# EAGLE design board (EAGLE 9.6.2)
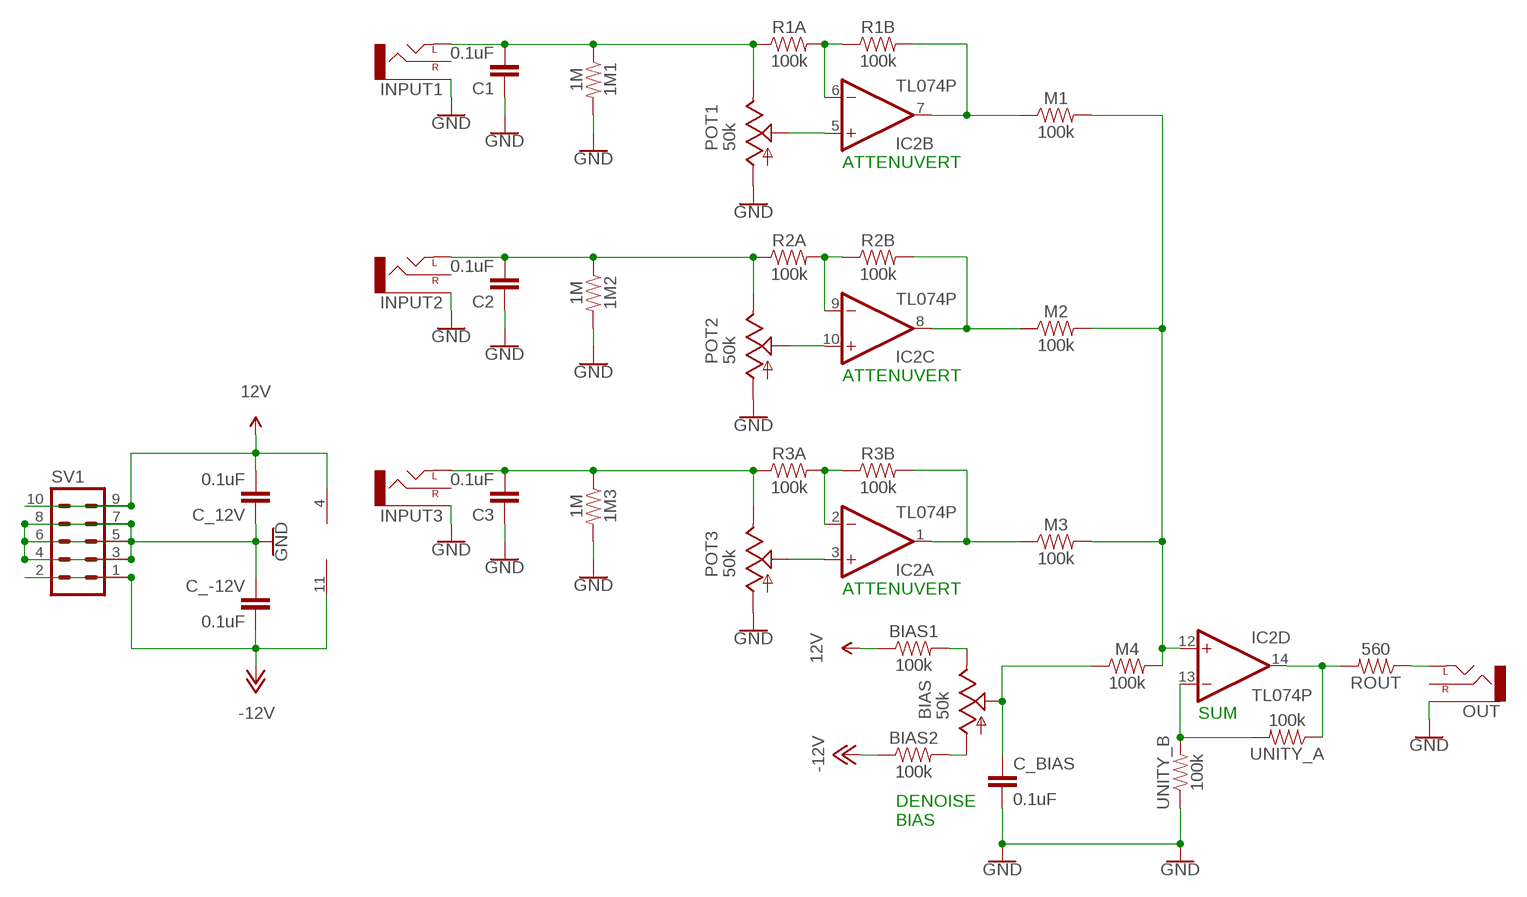
[diagram p0: schematic, sheet 1]

## Parts
1M1  1M  1MOHM-HORIZ-1/4W-5%  [AXIAL-0.3]
1M2  1M  1MOHM-HORIZ-1/4W-5%  [AXIAL-0.3]
1M3  1M  1MOHM-HORIZ-1/4W-5%  [AXIAL-0.3]
BIAS  50k  9MM_SNAP-IN_POT_  [9MM_SNAP-IN_POT]
BIAS1  100k  100KOHM-HORIZ-1/4W-1%  [AXIAL-0.3]
BIAS2  100k  100KOHM-HORIZ-1/4W-1%  [AXIAL-0.3]
C1  0.1uF  0.1UF-KIT-EZ-50V-20%  [CAP-PTH-SMALL-KIT]
C2  0.1uF  0.1UF-KIT-EZ-50V-20%  [CAP-PTH-SMALL-KIT]
C3  0.1uF  0.1UF-KIT-EZ-50V-20%  [CAP-PTH-SMALL-KIT]
C_12V  0.1uF  0.1UF-KIT-EZ-50V-20%  [CAP-PTH-SMALL-KIT]
C_-12V  0.1uF  0.1UF-KIT-EZ-50V-20%  [CAP-PTH-SMALL-KIT]
C_BIAS  0.1uF  0.1UF-KIT-EZ-50V-20%  [CAP-PTH-SMALL-KIT]
IC2  TL074P  [DIL14]
INPUT1  THONKI-STEREO  [WQP-PJ366ST_JACK]
INPUT2  THONKI-STEREO  [WQP-PJ366ST_JACK]
INPUT3  THONKI-STEREO  [WQP-PJ366ST_JACK]
M1  100k  100KOHM-HORIZ-1/4W-1%  [AXIAL-0.3]
M2  100k  100KOHM-HORIZ-1/4W-1%  [AXIAL-0.3]
M3  100k  100KOHM-HORIZ-1/4W-1%  [AXIAL-0.3]
M4  100k  100KOHM-HORIZ-1/4W-1%  [AXIAL-0.3]
OUT  THONKI-STEREO  [WQP-PJ366ST_JACK]
POT1  50k  9MM_SNAP-IN_POT_  [9MM_SNAP-IN_POT]
POT2  50k  9MM_SNAP-IN_POT_  [9MM_SNAP-IN_POT]
POT3  50k  9MM_SNAP-IN_POT_  [9MM_SNAP-IN_POT]
R1A  100k  100KOHM-HORIZ-1/4W-1%  [AXIAL-0.3]
R1B  100k  100KOHM-HORIZ-1/4W-1%  [AXIAL-0.3]
R2A  100k  100KOHM-HORIZ-1/4W-1%  [AXIAL-0.3]
R2B  100k  100KOHM-HORIZ-1/4W-1%  [AXIAL-0.3]
R3A  100k  100KOHM-HORIZ-1/4W-1%  [AXIAL-0.3]
R3B  100k  100KOHM-HORIZ-1/4W-1%  [AXIAL-0.3]
ROUT  560  100KOHM-HORIZ-1/4W-1%  [AXIAL-0.3]
SV1  EURO_POWER_HEADERFAT_PADS  [EURO_PWR_HEADER_FAT]
UNITY_A  100k  100KOHM-HORIZ-1/4W-1%  [AXIAL-0.3]
UNITY_B  100k  100KOHM-HORIZ-1/4W-1%  [AXIAL-0.3]

## Nets
12V: BIAS1.P$1 C_12V.2 IC2.4(P:V+) SV1.9 SV1.10
-12V: BIAS2.P$1 C_-12V.2 IC2.11(P:V-) SV1.1 SV1.2
GND: 1M1.P$2 1M2.P$2 1M3.P$2 C1.1 C2.1 C3.1 C_12V.1 C_-12V.1 C_BIAS.2 INPUT1.P$3_SLEEVE(SLEEVE) INPUT2.P$3_SLEEVE(SLEEVE) INPUT3.P$3_SLEEVE(SLEEVE) OUT.P$3_SLEEVE(SLEEVE) POT1.1(A) POT2.1(A) POT3.1(A) SV1.3 SV1.4 SV1.5 SV1.6 SV1.7 SV1.8 UNITY_B.P$1
N$1: OUT.P$1_TIP(LEFT) ROUT.P$1
N$3: IC2.14(D:OUT) ROUT.P$2 UNITY_A.P$1
N$4: BIAS1.P$2 BIAS.3(E)
N$5: BIAS2.P$2 BIAS.1(A)
N$6: BIAS.2(S) C_BIAS.1 M4.P$1
N$8: IC2.12(D:+IN) M1.P$2 M2.P$2 M3.P$2 M4.P$2
N$12: IC2.13(D:-IN) UNITY_A.P$2 UNITY_B.P$2
N$14: IC2.7(B:OUT) M1.P$1 R1B.P$2
N$15: IC2.6(B:-IN) R1A.P$2 R1B.P$1
N$16: 1M1.P$1 C1.2 INPUT1.P$1_TIP(LEFT) POT1.3(E) R1A.P$1
N$17: IC2.5(B:+IN) POT1.2(S)
N$18: IC2.8(C:OUT) M2.P$1 R2B.P$2
N$19: IC2.9(C:-IN) R2A.P$2 R2B.P$1
N$20: 1M2.P$1 C2.2 INPUT2.P$1_TIP(LEFT) POT2.3(E) R2A.P$1
N$21: IC2.10(C:+IN) POT2.2(S)
N$22: IC2.1(A:OUT) M3.P$1 R3B.P$2
N$23: IC2.2(A:-IN) R3A.P$2 R3B.P$1
N$24: 1M3.P$1 C3.2 INPUT3.P$1_TIP(LEFT) POT3.3(E) R3A.P$1
N$25: IC2.3(A:+IN) POT3.2(S)
Unconnected: INPUT1.P$2_SWITCH(RIGHT) INPUT2.P$2_SWITCH(RIGHT) INPUT3.P$2_SWITCH(RIGHT) OUT.P$2_SWITCH(RIGHT)

## Notes on the sheet
- ATTENUVERT
- ATTENUVERT
- ATTENUVERT
- SUM
- DENOISE
  BIAS

## Library data of the parts
1M1-1M3 = SparkFun-Resistors:1MOHM: 1MΩ resistor A resistor is a passive two-terminal electrical component that implements electrical resistance as a circuit element. Resistors act to reduce current flow, and, at the same time, act to lower voltage levels within circuits. - Wikipedia; PROD_ID: RES-09329
BIAS POT1-POT3 = MusicThingModular:9MM_SNAP-IN_POT: 9mm vertical snap-in pot, Alpha / Panasonic style
BIAS1 BIAS2 M1-M4 R1A R1B R2A R2B R3A R3B UNITY_A UNITY_B = SparkFun-Resistors:100KOHM: 100kΩ resistor A resistor is a passive two-terminal electrical component that implements electrical resistance as a circuit element. Resistors act to reduce current flow, and, at the same time, act to lower voltage levels within circuits. - Wikipedia; PROD_ID: RES-12184
C1-C3 C_12V C_-12V C_BIAS = SparkFun-Capacitors:0.1UF: 0.1µF ceramic capacitors A capacitor is a passive two-terminal electrical component used to store electrical energy temporarily in an electric field.; PROD_ID: CAP-08370
IC2 = linear:TL074: OP AMP
INPUT1-INPUT3 OUT = MusicThingModular:THONKI-STEREO: 3.5mm socket for Eurorack modular synths
ROUT = SparkFun-Resistors:100KOHM: 100kΩ resistor A resistor is a passive two-terminal electrical component that implements electrical resistance as a circuit element. Resistors act to reduce current flow, and, at the same time, act to lower voltage levels within circuits. - Wikipedia; PROD_ID: RES-12184; VALUE: 100k
SV1 = MusicThingModular:EURO_POWER_HEADER: Power Header 10 pin power header for Eurorack Power Supplies Variants with fatter pads for easier soldering, and the LOCK variant which has 5mil offset pins to hold the component in place before soldering

## Board
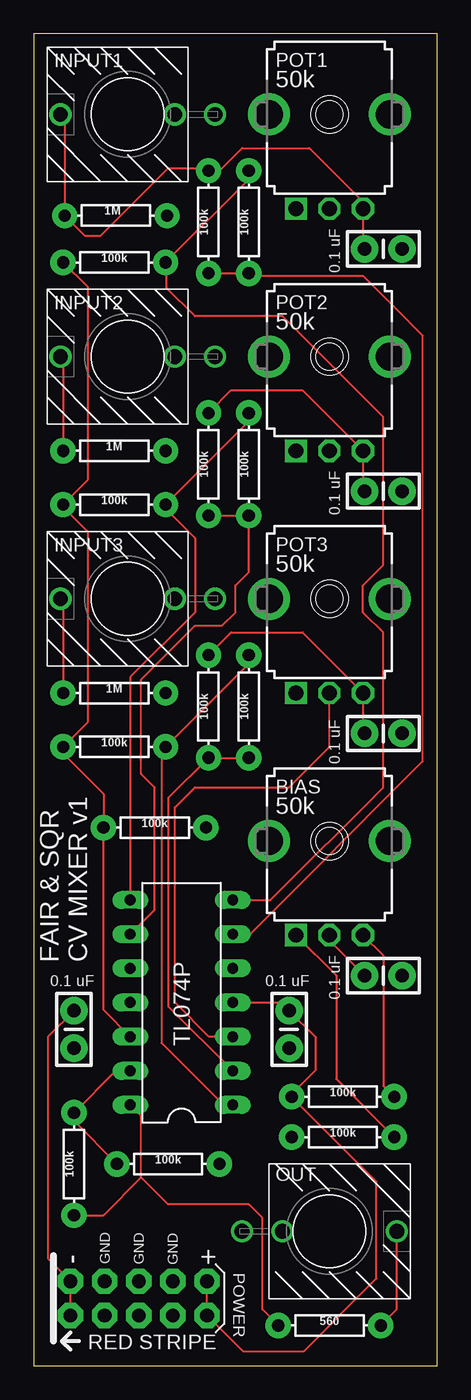
[diagram p1: board, top side]
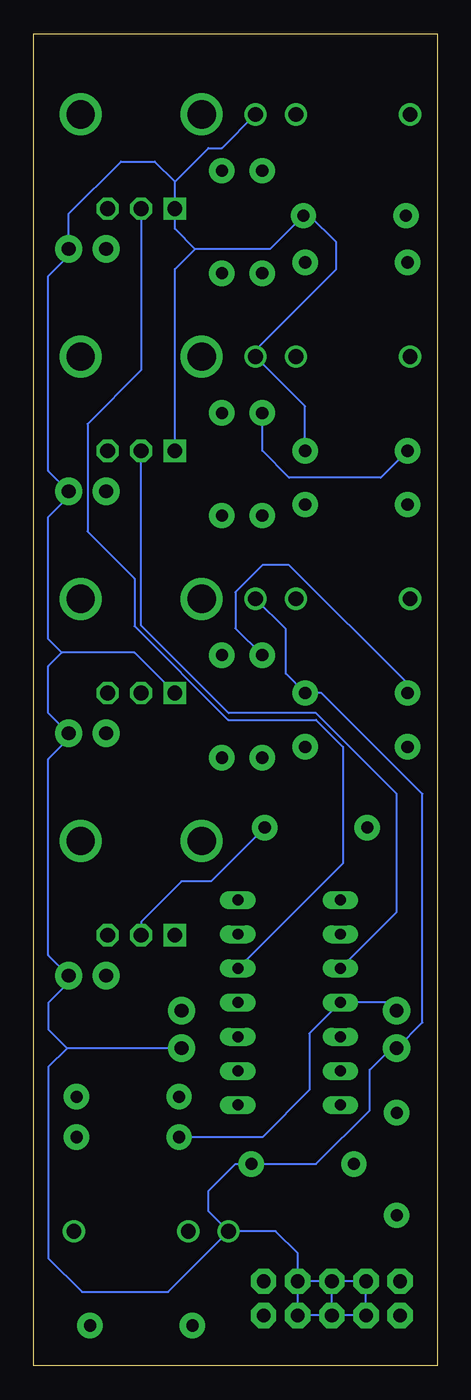
[diagram p2: board, bottom side, seen from below]

Size 30 x 99 mm. Coordinates in mm from the lower left corner, seen from the top.
Outline: 0,0 30,0 30,99 0,99 0,0
Copper layers (1*16): Top 0.035mm / dielectric 1.5mm / Bottom 0.035mm
Design rules "default": minimum track width 6mil, minimum drill 0.35mm, track to track 6mil, track to pad 6mil, pad to pad 6mil, via to via 6mil, smd to smd 6mil, copper to edge 40mil, drill to drill 6mil, minimum pad ring 10mil, minimum via ring 8mil, stop-mask expansion 4mil, vias tented up to drill 0mil, thermal gap 10mil

### Footprints (pad centres in the part's own frame; a part is rotated, then mirrored left to right if it is on the bottom)
AXIAL-0.3 = drill 0.9 pad 1.88: P$1 -3.81,0; P$2 3.81,0
9MM_SNAP-IN_POT = drill 1.1 square: 1 -2.5,-7 | drill 1.1 octagon: 2 0,-7; 3 2.5,-7 | drill 2.1 pad 2.794: CHASSIS1 -4.5,0; CHASSIS2 4.5,0
CAP-PTH-SMALL-KIT = drill 1.016 pad 2.032: 1 -1.397,0; 2 1.397,0
DIL14 = drill 0.813 long: 1 -7.62,-3.81; 2 -5.08,-3.81; 3 -2.54,-3.81; 4 0,-3.81; 5 2.54,-3.81; 6 5.08,-3.81; 7 7.62,-3.81; 8 7.62,3.81; 9 5.08,3.81; 10 2.54,3.81; 11 0,3.81; 12 -2.54,3.81; 13 -5.08,3.81; 14 -7.62,3.81
WQP-PJ366ST_JACK = drill 1.1: P$1_TIP 0,5; P$2_SWITCH 0,-3.5; P$3_SLEEVE 0,-6.5
EURO_PWR_HEADER_FAT = drill 1.016 pad 1.88 octagon: 1 -5.08,-1.27; 2 -5.08,1.27; 3 -2.54,-1.27; 4 -2.54,1.27; 5 0,-1.27; 6 0,1.27; 7 2.54,-1.27; 8 2.54,1.27; 9 5.08,-1.27; 10 5.08,1.27

### Placement (x,y rotation side)
1M1  6.12,85.48 0 top
1M2  6,68 0 top
1M3  6,50 0 top
BIAS  22,39 0 top
BIAS1  23,20 0 top
BIAS2  23,17 0 top
C1  26,83 180 top
C2  26,65 180 top
C3  26,47 180 top
C_12V  19,25 90 top
C_-12V  3,25 90 top
C_BIAS  26,29 0 top
IC2  11,27 90 top
INPUT1  7,93 90 top
INPUT2  7,75 90 top
INPUT3  7,57 90 top
M1  6,82 180 top
M2  6,64 180 top
M3  6,46 180 top
M4  9,40 180 top
OUT  22,10 270 top
POT1  22,93 0 top
POT2  22,75 0 top
POT3  22,57 0 top
R1A  13,85 270 top
R1B  16,85 90 top
R2A  13,67 270 top
R2B  16,67 90 top
R3A  13,49 270 top
R3B  16,49 90 top
ROUT  22,3 180 top
SV1  7.82,5.02 0 top
UNITY_A  3,15 90 top
UNITY_B  10,15 180 top

### Tracks (layer width: path | path; a pad name or v marks a point on that pad's centre or on a via)
12V
  Top 0.152: IC2.4 18.4,27 C_12V.2 21,24.4 21,22 19.19,20.19 BIAS1.P$1 25.5,13.69 25.5,6.5 20.09,1.09 15.56,1.09 SV1.9 SV1.10
-12V
  Top 0.152: SV1.1 SV1.2 1.09,7.94 1.09,24.49 C_-12V.2
  Bottom 0.152: C_-12V.2 3.6,27 IC2.11 9.5,24.69 9.5,20.5 13,17 BIAS2.P$1
GND
  Bottom 0.152: INPUT1.P$3_SLEEVE 16,90.5 17,90.5 19.5,88 | 18,83 12.41,83 1M1.P$2 9.48,85.48 7.5,83.5 7.5,81.5 13.5,75.5 INPUT2.P$3_SLEEVE 9.81,71.31 1M2.P$2 | 18,83 19.5,84.5 POT1.1 19.5,88 | 18,83 19.5,81.5 POT2.1 | SV1.5 SV1.6 | SV1.8 SV1.7 SV1.5 | SV1.6 SV1.4 SV1.3 SV1.5 | SV1.6 SV1.8 | SV1.8 10.36,8.36 12,10 OUT.P$3_SLEEVE | OUT.P$3_SLEEVE 20,5.5 26.41,5.5 28.91,8 28.91,22.21 27.51,23.6 | INPUT3.P$3_SLEEVE 11.25,54.75 11.25,51.44 1M3.P$2 8.59,50 1.09,42.5 1.09,25.51 C_-12V.1 3.4,23.6 5,22 5,19 9,15 UNITY_B.P$1 15,15 17,13 17,11.5 OUT.P$3_SLEEVE | POT3.1 22.5,53 27.91,53 | 27.91,53 28.91,52 28.91,48.51 C3.1 27.4,46.6 28.91,45.09 28.91,30.51 C_BIAS.2 27.4,28.5 28.91,26.99 28.91,25 27.51,23.6 | 27.91,53 28.91,54 28.91,63.09 27.4,64.6 C2.1 28.91,66.51 28.91,80.99 27.4,82.5 C1.1 27.4,85.6 23.5,89.5 21,89.5 19.5,88 | C_12V.1 27.51,23.6
N$1
  Top 0.152: ROUT.P$1 27,4.19 OUT.P$1_TIP
N$3
  Top 0.152: UNITY_A.P$1 5.19,11.19 8,14 | IC2.14 8,18.57 8,14 | ROUT.P$2 17,4.19 17,11 16,12 10,12 8,14
N$4
  Top 0.152: BIAS.3 26,30.5 26,20.81 BIAS1.P$2
N$5
  Top 0.152: BIAS.1 22.5,29 22.5,21.31 BIAS2.P$2
N$6
  Top 0.152: BIAS.2 22,31.6 C_BIAS.1
  Bottom 0.152: M4.P$1 16.81,36 19,36 22,33 BIAS.2
N$8
  Top 0.152: M1.P$2 4,80.19 4,65.81 M2.P$2 2.19,63.81 4,62 4,47.81 M3.P$2 2.19,45.5 5.19,42.5 M4.P$2 5.19,26.46 IC2.12
N$12
  Top 0.152: UNITY_B.P$2 3,18.19 UNITY_A.P$2 6.11,21.92 IC2.13
N$14
  Top 0.152: M1.P$1 9.9,82.09 | 9.9,82.09 16,88.19 R1B.P$2 | IC2.7 17.62,34.62 26,43 26,54.5 24.5,56 24.5,58 26,59.5 26,70.5 18.5,78 12,78 9.9,80.09 9.9,82.09
N$15
  Top 0.152: R1A.P$2 R1B.P$1 16.19,81 24.5,81 28.91,76.59 28.91,44.91 16,32 14.89,32 IC2.6
N$16
  Top 0.152: INPUT1.P$1_TIP 2.31,92.69 1M1.P$1 3.79,84 5,84 10,89 12.81,89 R1A.P$1 13.81,88.81 15.5,90.5 20.5,90.5 24.5,86.5 POT1.3 24.5,83.1 C1.2
N$17
  Bottom 0.152: POT1.2 22,74 26,70 26,62 22.5,58.5 22.5,54.97 15.53,48 9,48 7,46 7,37.35 IC2.5
N$18
  Top 0.152: R2B.P$2 16,70.19 M2.P$1 9.81,63.69 12,61.5 12,56 7.19,51.19 IC2.8
N$19
  Top 0.152: R2A.P$2 R2B.P$1 16,59 15,58 15,56 14,55 12,55 8,51 8,44 9,43 9,33.89 IC2.9
N$20
  Top 0.152: INPUT2.P$1_TIP 2.19,74.81 1M2.P$1 | C2.2 24.5,65.1 POT2.3 20,72.5 14.69,72.5 R2A.P$1
  Bottom 0.152: 1M2.P$1 4.19,66 11,66 13,68 R2A.P$1
N$21
  Bottom 0.152: IC2.10 3,33.73 3,42.5 9,48.5 15.5,48.5 22,55 POT2.2
N$22
  Top 0.152: R3B.P$2 16,52.19 M3.P$1 9.5,45.69 9.5,24 14.12,19.38 IC2.1
N$23
  Top 0.152: R3B.P$1 R3A.P$2 10,42.19 10,26.73 IC2.2
N$24
  Top 0.152: INPUT3.P$1_TIP 2.19,56.81 1M3.P$1 | R3A.P$1 14.69,54.5 20,54.5 POT3.3 24.5,47.1 C3.2
  Bottom 0.152: 1M3.P$1 2.19,50.69 11,59.5 13,59.5 15,57.5 15,54.81 R3A.P$1
N$25
  Top 0.152: IC2.3 13.04,24.46 10.5,27 10.5,41.5 12,43 19,43 22,46 POT3.2

### Text on the board
tPlace: 0.1 uF | 0.1 uF | 0.1 uF | FAIR & SQR / CV MIXER v1 | 0.1 uF | 0.1 uF | 0.1 uF